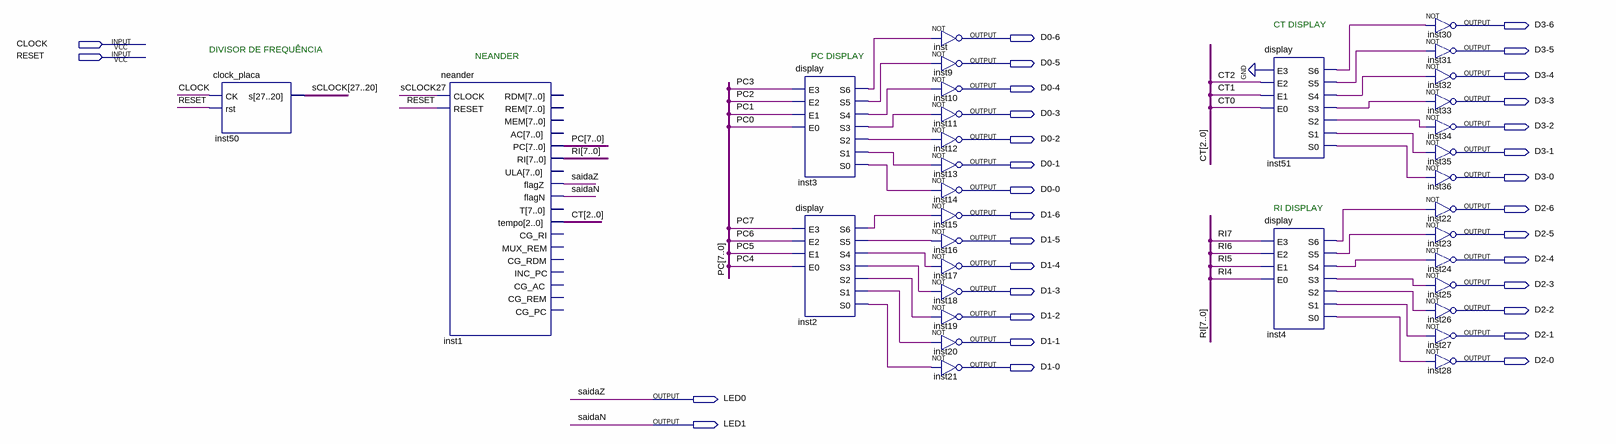
[diagram p0: schematic sheet]
// Quartus schematic neander_placa.bdf as structural Verilog: 34 symbols, 32 pins
module neander_placa (
  input  CLOCK,
  input  RESET,
  output \D3-6 ,
  output \D0-6 ,
  output \D3-5 ,
  output \D0-5 ,
  output \D3-4 ,
  output \D0-4 ,
  output \D3-3 ,
  output \D0-3 ,
  output \D3-2 ,
  output \D0-2 ,
  output \D3-1 ,
  output \D0-1 ,
  output \D3-0 ,
  output \D0-0 ,
  output \D2-6 ,
  output \D1-6 ,
  output \D2-5 ,
  output \D1-5 ,
  output \D2-4 ,
  output \D1-4 ,
  output \D2-3 ,
  output \D1-3 ,
  output \D2-2 ,
  output \D1-2 ,
  output \D2-1 ,
  output \D1-1 ,
  output \D2-0 ,
  output \D1-0 ,
  output LED0,
  output LED1
);

  wire inst2_s0, inst2_s1, inst2_s2, inst2_s3, inst2_s4, inst2_s5, inst2_s6, inst3_s0, inst3_s1, inst3_s2,
       inst3_s3, inst3_s4, inst3_s5, inst3_s6, inst4_s0, inst4_s1, inst4_s2, inst4_s3, inst4_s4, inst4_s5,
       inst4_s6, inst51_s0, inst51_s1, inst51_s2, inst51_s3, inst51_s4, inst51_s5, inst51_s6;
  wire [2:0] CT;
  wire [7:0] PC, RI;
  wire [27:20] sCLOCK;

  clock_placa inst50 (.CK(CLOCK), .rst(RESET), .s(sCLOCK));
  neander inst1 (
    .CLOCK(sCLOCK[27]), .RESET(RESET), .PC(PC), .RI(RI), .flagZ(LED0), .flagN(LED1), .tempo(CT));  // open: RDM, REM, MEM, AC, ULA, T, CG_RI, MUX_REM, CG_RDM, INC_PC, CG_AC, CG_REM, CG_PC
  display inst3 (
    .E3(PC[3]), .E2(PC[2]), .E1(PC[1]), .E0(PC[0]), .S6(inst3_s6), .S5(inst3_s5), .S4(inst3_s4),
    .S3(inst3_s3), .S2(inst3_s2), .S1(inst3_s1), .S0(inst3_s0));
  display inst2 (
    .E3(PC[7]), .E2(PC[6]), .E1(PC[5]), .E0(PC[4]), .S6(inst2_s6), .S5(inst2_s5), .S4(inst2_s4),
    .S3(inst2_s3), .S2(inst2_s2), .S1(inst2_s1), .S0(inst2_s0));
  not inst (\D0-6 , inst3_s6);
  not inst9 (\D0-5 , inst3_s5);
  not inst10 (\D0-4 , inst3_s4);
  not inst11 (\D0-3 , inst3_s3);
  not inst12 (\D0-2 , inst3_s2);
  not inst13 (\D0-1 , inst3_s1);
  not inst14 (\D0-0 , inst3_s0);
  not inst15 (\D1-6 , inst2_s6);
  not inst16 (\D1-5 , inst2_s5);
  not inst17 (\D1-4 , inst2_s4);
  not inst18 (\D1-3 , inst2_s3);
  not inst19 (\D1-2 , inst2_s2);
  not inst20 (\D1-1 , inst2_s1);
  not inst21 (\D1-0 , inst2_s0);
  display inst51 (
    .E3(1'b0), .E2(CT[2]), .E1(CT[1]), .E0(CT[0]), .S6(inst51_s6), .S5(inst51_s5), .S4(inst51_s4),
    .S3(inst51_s3), .S2(inst51_s2), .S1(inst51_s1), .S0(inst51_s0));
  display inst4 (
    .E3(RI[7]), .E2(RI[6]), .E1(RI[5]), .E0(RI[4]), .S6(inst4_s6), .S5(inst4_s5), .S4(inst4_s4),
    .S3(inst4_s3), .S2(inst4_s2), .S1(inst4_s1), .S0(inst4_s0));
  not inst30 (\D3-6 , inst51_s6);
  not inst31 (\D3-5 , inst51_s5);
  not inst32 (\D3-4 , inst51_s4);
  not inst33 (\D3-3 , inst51_s3);
  not inst34 (\D3-2 , inst51_s2);
  not inst35 (\D3-1 , inst51_s1);
  not inst36 (\D3-0 , inst51_s0);
  not inst22 (\D2-6 , inst4_s6);
  not inst23 (\D2-5 , inst4_s5);
  not inst24 (\D2-4 , inst4_s4);
  not inst25 (\D2-3 , inst4_s3);
  not inst26 (\D2-2 , inst4_s2);
  not inst27 (\D2-1 , inst4_s1);
  not inst28 (\D2-0 , inst4_s0);

  // Other names for the same wires on the sheet: saidaN = LED1; saidaZ = LED0

  // Notes on the sheet:
  //   CT DISPLAY
  //   DIVISOR DE FREQUÊNCIA
  //   NEANDER
  //   PC DISPLAY
  //   RI DISPLAY
endmodule
